# Altium schematic sheet pca10201_switch_nx.SchDoc: =BoardTitle + ' - Switch NX'
size A3; Organization: Nordic Semiconductor; DocumentNumber: 10; SheetNumber: 10; SheetTotal: 10; CompanyName: Nordic Semiconductor; DocumentSize: A4
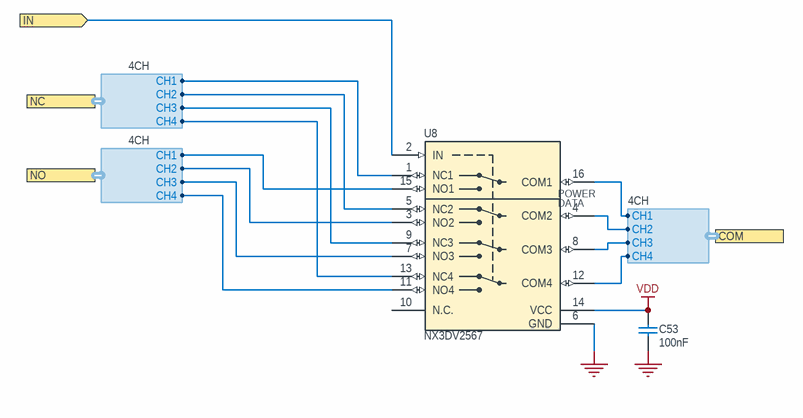
[diagram p0: pca10201_switch_nx.SchDoc]

## Parts
C53  100nF  [CAPC0603X03L_C]
U8  NX3DV2567  [XQFN40P180X260X50-16N]

## Ports
COM (harness 4CH), IN (in), NC (harness 4CH), NO (harness 4CH)

## Harnesses
4CH: CH1, CH2, CH3, CH4

## Nets
GND: C53.2 U8.6(GND)
VDD: C53.1 U8.14(VCC)
IN: U8.2(IN) ; port IN
NetU8_1: U8.1(NC1) ; port NC.CH1
NetU8_3: U8.3(NO2) ; port NO.CH2
NetU8_4: U8.4(COM2) ; port COM.CH2
NetU8_5: U8.5(NC2) ; port NC.CH2
NetU8_7: U8.7(NO3) ; port NO.CH3
NetU8_8: U8.8(COM3) ; port COM.CH3
NetU8_9: U8.9(NC3) ; port NC.CH3
NetU8_11: U8.11(NO4) ; port NO.CH4
NetU8_12: U8.12(COM4) ; port COM.CH4
NetU8_13: U8.13(NC4) ; port NC.CH4
NetU8_15: U8.15(NO1) ; port NO.CH1
NetU8_16: U8.16(COM1) ; port COM.CH1

Not connected (* = marked no-connect by the designer): U8 10(N.C.)

## Notes on the sheet
- Title
- Size
- Date:
- File:
- A3
- PCB Assembly Number
- Sheet
- Drawn By:
- Revision
- of
- Classification:
- (in symbol NX3DV2567GU) POWER; DATA

## Library data of the parts
C53 = C0201-100n: Capacitor, X5R, ±10%, 100nF, 16V; Manufacturer: N.A.; Part number IPS: 00000001248, 00000002505; Part number Norautron: 262071862; Part number NEMS: 100200078; Pad Count: 2; Component Status: Active; Part Number: C0201-100n; Manufacturer Part Number: N.A.; ComponentLink1URL: N.A.; ComponentLink1Description: Datasheet; ComponentLink2URL: N.A.; ComponentLink2Description: Supplier link; HelpURL: N.A.; Footprint Doc: 0201; LatestRevisionDate: 2024-06-27; Published: 2014-11-13; Value: 100nF; Note: 16V; Artikkelnr Noca: N.A.; Supplier 1: N.A.; Supplier Part Number 1: N.A.; Supplier 2: N.A.; Supplier Part Number 2: N.A.; Component Class: Capacitors; PartId: 100200078; Author: rsk
U8 = NX3DV2567GU: Low-ohmic four-pole double-throw analog switch; Manufacturer: NXP Semiconductors; Part number IPS: 00000007816; Part number NEMS: 101900290; Note: N.A.; Artikkelnr Noca: 15079317; Pad Count: 16; Component Status: Active; Part Number: NX3DV2567GU; Manufacturer Part Number: NX3DV2567GU; Footprint Doc: XQFN-16; LatestRevisionDate: 2015-02-17; Published: 2015-02-17; Value: NX3DV2567; ComponentLink1URL: N.A.; ComponentLink1Description: Datasheet; ComponentLink2URL: N.A.; ComponentLink2Description: Supplier link; HelpURL: http://www.nxp.com/documents/data_sheet/NX3DV2567.pdf; Supplier 1: Digi-Key; Supplier Part Number 1: 568-5206-1-ND; Supplier 2: Mouser; Supplier Part Number 2: 771-NX3DV2567GU115; PartId: 101900290; Component Class: Misc_ICs; Author: rsk; Part number Norautron: N.A.